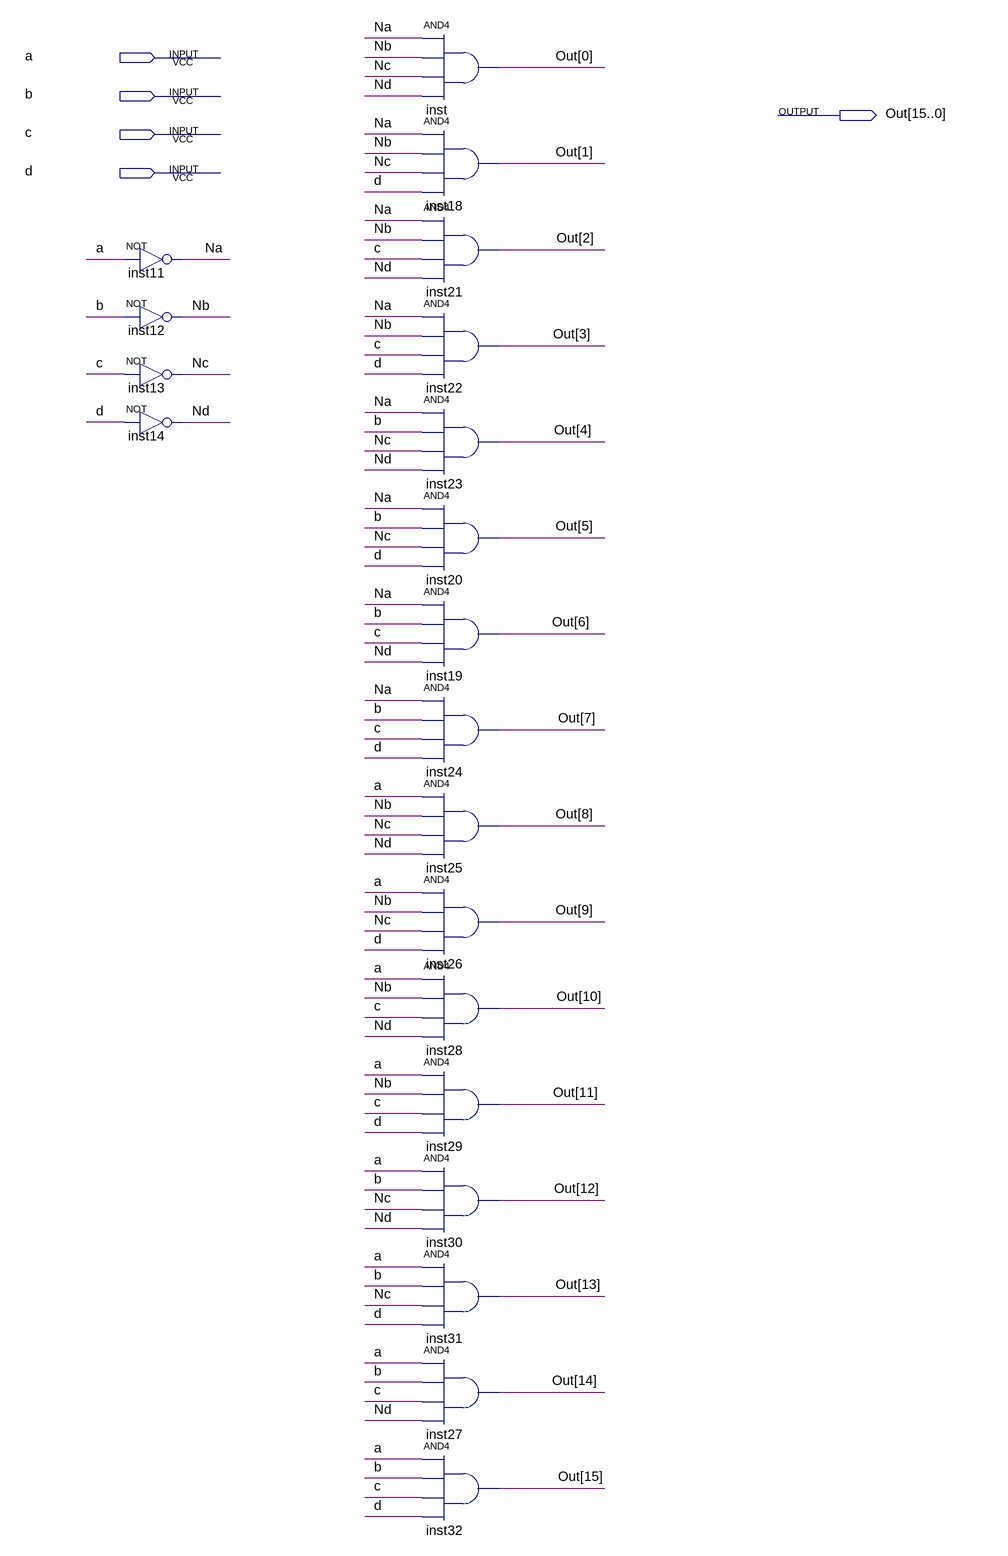
[diagram p0: schematic sheet]
// Quartus schematic DECOD_4x16.bdf as structural Verilog: 20 symbols, 5 pins
module DECOD_4x16 (
  input  a,
  input  b,
  input  c,
  input  d,
  output [15:0] Out
);

  wire Na, Nb, Nc, Nd;

  not inst11 (Na, a);
  not inst12 (Nb, b);
  not inst13 (Nc, c);
  not inst14 (Nd, d);
  and inst (Out[0], Na, Nb, Nc, Nd);
  and inst18 (Out[1], Na, Nb, Nc, d);
  and inst21 (Out[2], Na, Nb, c, Nd);
  and inst22 (Out[3], Na, Nb, c, d);
  and inst23 (Out[4], Na, b, Nc, Nd);
  and inst20 (Out[5], Na, b, Nc, d);
  and inst19 (Out[6], Na, b, c, Nd);
  and inst24 (Out[7], Na, b, c, d);
  and inst25 (Out[8], a, Nb, Nc, Nd);
  and inst26 (Out[9], a, Nb, Nc, d);
  and inst28 (Out[10], a, Nb, c, Nd);
  and inst29 (Out[11], a, Nb, c, d);
  and inst30 (Out[12], a, b, Nc, Nd);
  and inst31 (Out[13], a, b, Nc, d);
  and inst27 (Out[14], a, b, c, Nd);
  and inst32 (Out[15], a, b, c, d);
endmodule
